# EasyEDA schematic Motor_wiring_with_DMC5400.json
TITLE: Motor Wiring with DMC5400; REV: 1.0; Date: 2022-05-27; Sheet: 1/1; Company: UKIM - FEIT
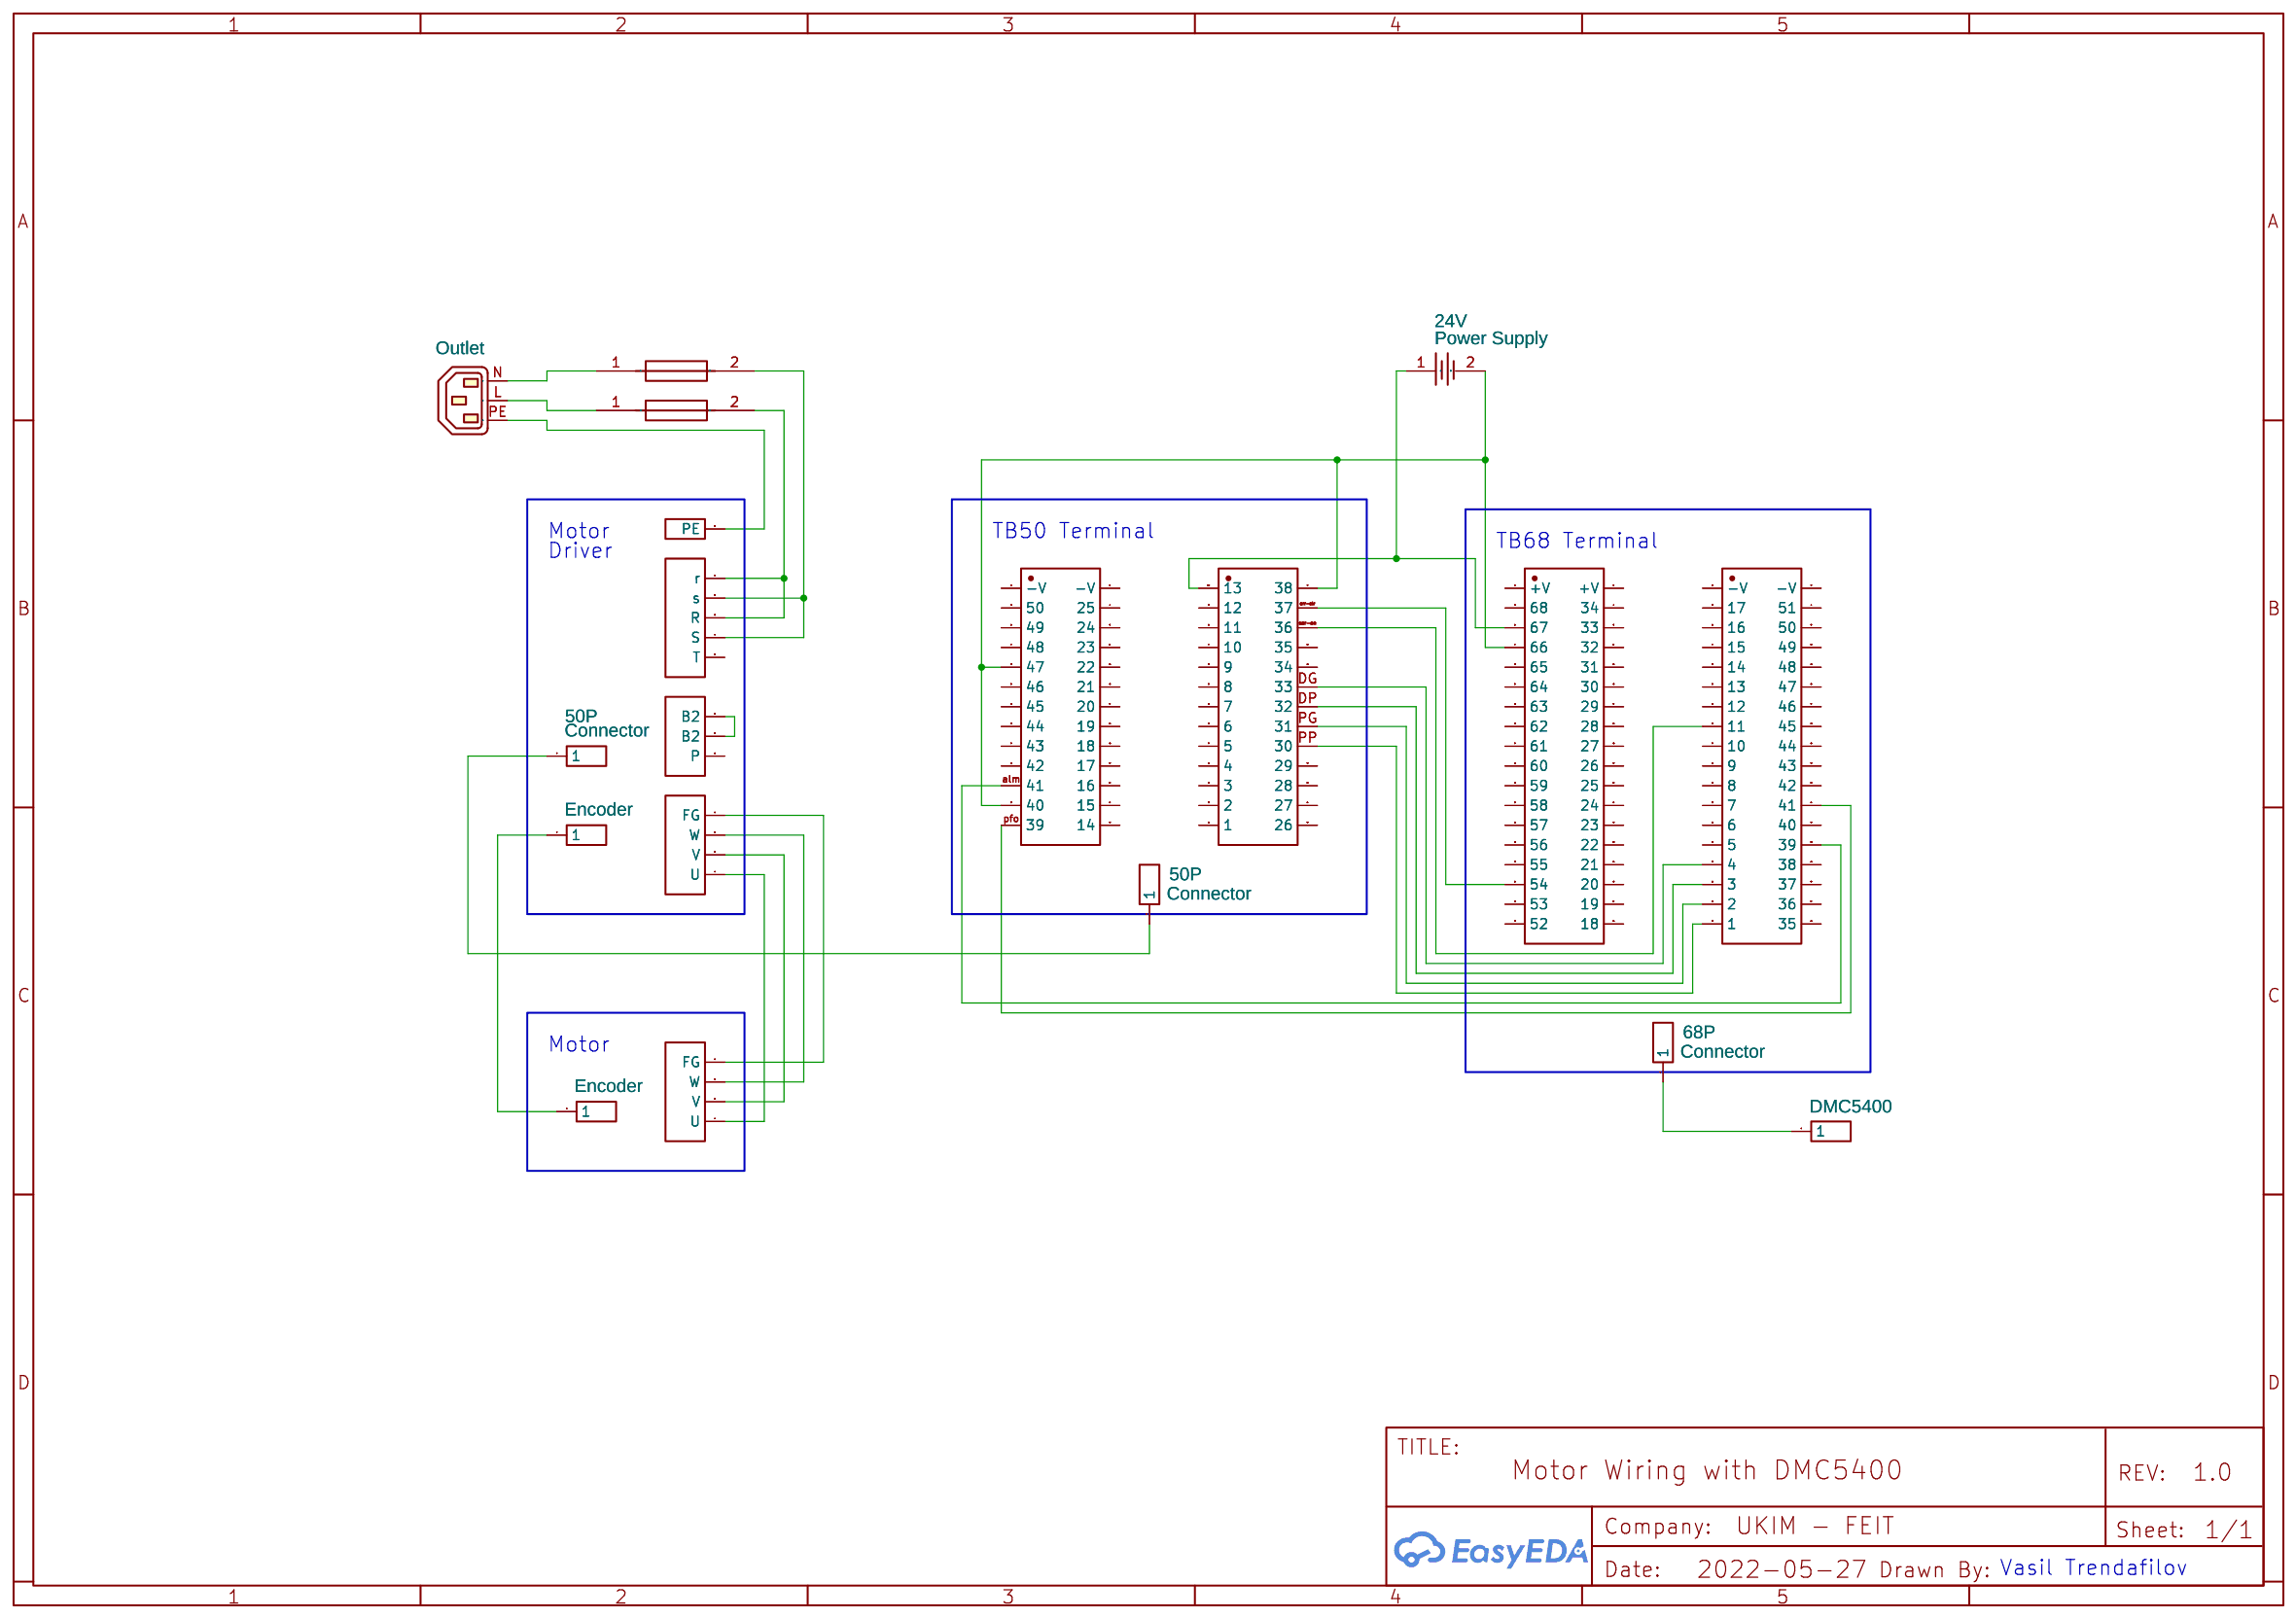
[diagram p0: schematic sheet]

## Parts
24V  Power Supply  [BAT-SMD_CR1220-2]
50P  Connector  [HDR-M-2.54_1X1]
50P#2  Connector  [HDR-M-2.54_1X1]
68P  Connector  [HDR-M-2.54_1X1]
CN1  CNJM2006WV-2X18P-9T  [CONN-TH_CNJM2006WV-2X18P-9T]
CN2  CNJM2006WV-2X18P-9T  [CONN-TH_CNJM2006WV-2X18P-9T]
H1  HDR-F-2.54_1x4  [HDR-F-2.54_1X4]
H2  HDR-F-2.54_1x3  [HDR-F-2.54_1X3]
H3  HDR-F-2.54_1x5  [HDR-F-2.54_1X5]
H4  HDR-F-2.54_1x4  [HDR-F-2.54_1X4]
J1  Encoder  [HDR-M-2.54_1X1]
J2  Encoder  [HDR-M-2.54_1X1]
J3  PE  [HDR-M-2.54_1X1]
J4  DMC5400  [HDR-M-2.54_1X1]
U1  A2005WV-N-2X13P_C2897444  [CONN-TH_A2005WV-N-2X13P]
U2  A2005WV-N-2X13P_C2897444  [CONN-TH_A2005WV-N-2X13P]
U4  RESETTABLEFUSE-500MA  [FUSE-TH-L12.5-W2.0-P5.00-D0.8]
U5  RESETTABLEFUSE-500MA  [FUSE-TH-L12.5-W2.0-P5.00-D0.8]
WALL  Outlet  [PX0675PC]

## Library data of the parts
24V = CR1220-2: Supplier: LCSC; Manufacturer: Q&J; image: //image.lceda.cn/szlcsc/C70381.jpg; Supplier Part: C70381
50P 50P#2 68P J1-J4 = HDR-M-2.54_1x1: Supplier Part: C81276; Supplier: LCSC; Contributor: LCEDA_Lib
CN1 CN2 = CNJM2006WV-2X18P-9T: Supplier: LCSC; Supplier Part: C881519; Manufacturer: CNJM(九木精密); Contributor: LCSC
H1 H4 = HDR-F-2.54_1x4: Supplier Part: C225501; Supplier: LCSC; Contributor: LCEDA_Lib
H2 = HDR-F-2.54_1x3: Supplier Part: C146690; Supplier: LCSC; Contributor: LCEDA_Lib
H3 = HDR-F-2.54_1x5: Supplier Part: C50950; Supplier: LCSC; Contributor: LCEDA_Lib
U1 U2 = A2005WV-N-2X13P_C2897444: Supplier: LCSC; Supplier Part: C2897444; Manufacturer: CJT(长江连接器); Manufacturer Part: A2005WV-N-2X13P; Contributor: LCSC
U4 U5 = RESETTABLEFUSE-500MA: Supplier: LCSC; Supplier Part: C9900007669; Manufacturer: null; Manufacturer Part: ResettableFuse-500mA; link: https://atta.szlcsc.comnull; Contributor: LCSC; JLCPCB Part Class: Extended Part
WALL = PX0675PCGY: IEC Mains Power Outlet, EN60 320-2-2 F Class I, PC Flange Rear Mount, Chassis Socket, Grey

## Nets
Net-(24V-1): 24V.1 CN1.5(67) U2.di-com+(13)
Net-(24V-2): 24V.2 CN1.7(66) U1.9(47) U1.23(40) U2.2(38)
Net-(50P-1): 50P.1 50P#2.1
Net-(68P-1): 68P.1 J4.1
Net-(CN1-31): CN1.31(54) U2.err-clr(37)
Net-(CN2-15): CN2.15(11) U2.ser-on(36)
Net-(CN2-24): CN2.24(41) U1.pfo(39)
Net-(CN2-28): CN2.28(39) U1.alm(41)
Net-(CN2-29): CN2.29(4) U2.DG(33)
Net-(CN2-31): CN2.31(3) U2.DP(32)
Net-(CN2-33): CN2.33(2) U2.PG(31)
Net-(CN2-35): CN2.35(1) U2.PP(30)
Net-(H1-1): H1.1(FG) H4.1(FG)
Net-(H1-2): H1.2(W) H4.2(W)
Net-(H1-3): H1.3(V) H4.3(V)
Net-(H1-4): H1.4(U) H4.4(U)
Net-(H2-1): H2.1(B2) H2.2(B2)
Net-(H3-1): H3.1(r) H3.3(R) U4.2
Net-(H3-2): H3.2(s) H3.4(S) U5.2
Net-(J1-1): J1.1 J2.1
Net-(J3-1): J3.1(PE) WALL.PE(N)
Net-(U4-1): U4.1 WALL.L(E)
Net-(U5-1): U5.1 WALL.N(L)

Not connected (* = marked no-connect by the designer): CN1 1(+V) 2(+V) 3(68) 4(34) 6(33) 8(32) 9(65) 10(31) 11(64) 12(30) 13(63) 14(29) 15(62) 16(28) 17(61) 18(27) 19(60) 20(26) 21(59) 22(25) 23(58) 24 25(57) 26(23) 27(56) 28(22) 29(55) 30(21) 32(20) 33(53) 34(19) 35(52) 36(18); CN2 1(-V) 2(-V) 3(17) 4(51) 5(16) 6(50) 7(15) 8(49) 9(14) 10(48) 11(13) 12(47) 13(12) 14(46) 16(45) 17(10) 18(44) 19(9) 20(43) 21(8) 22(42) 23(7) 25(6) 26(40) 27(5) 30(38) 32(37) 34(36) 36(35); H2 3(P); H3 5(T); U1 1(-V) 2(-V) 3(50) 4(25) 5(49) 6(24) 7(48) 8(23) 10(22) 11(46) 12(21) 13(45) 14(20) 15(44) 16(19) 17(43) 18 19(42) 20(17) 22(16) 24(15) 26(14); U2 3(12) 5(11) 7(10) 8(35) 9 10(34) 11(8) 13(7) 15(6) 17(5) 19(4) 20(29) 21(3) 22(28) 23(2) 24(27) 25(1) 26

## Notes on the sheet
- Motor
- TB50 Terminal
- TB68 Terminal
- Driver
- Motor
- Vasil Trendafilov
